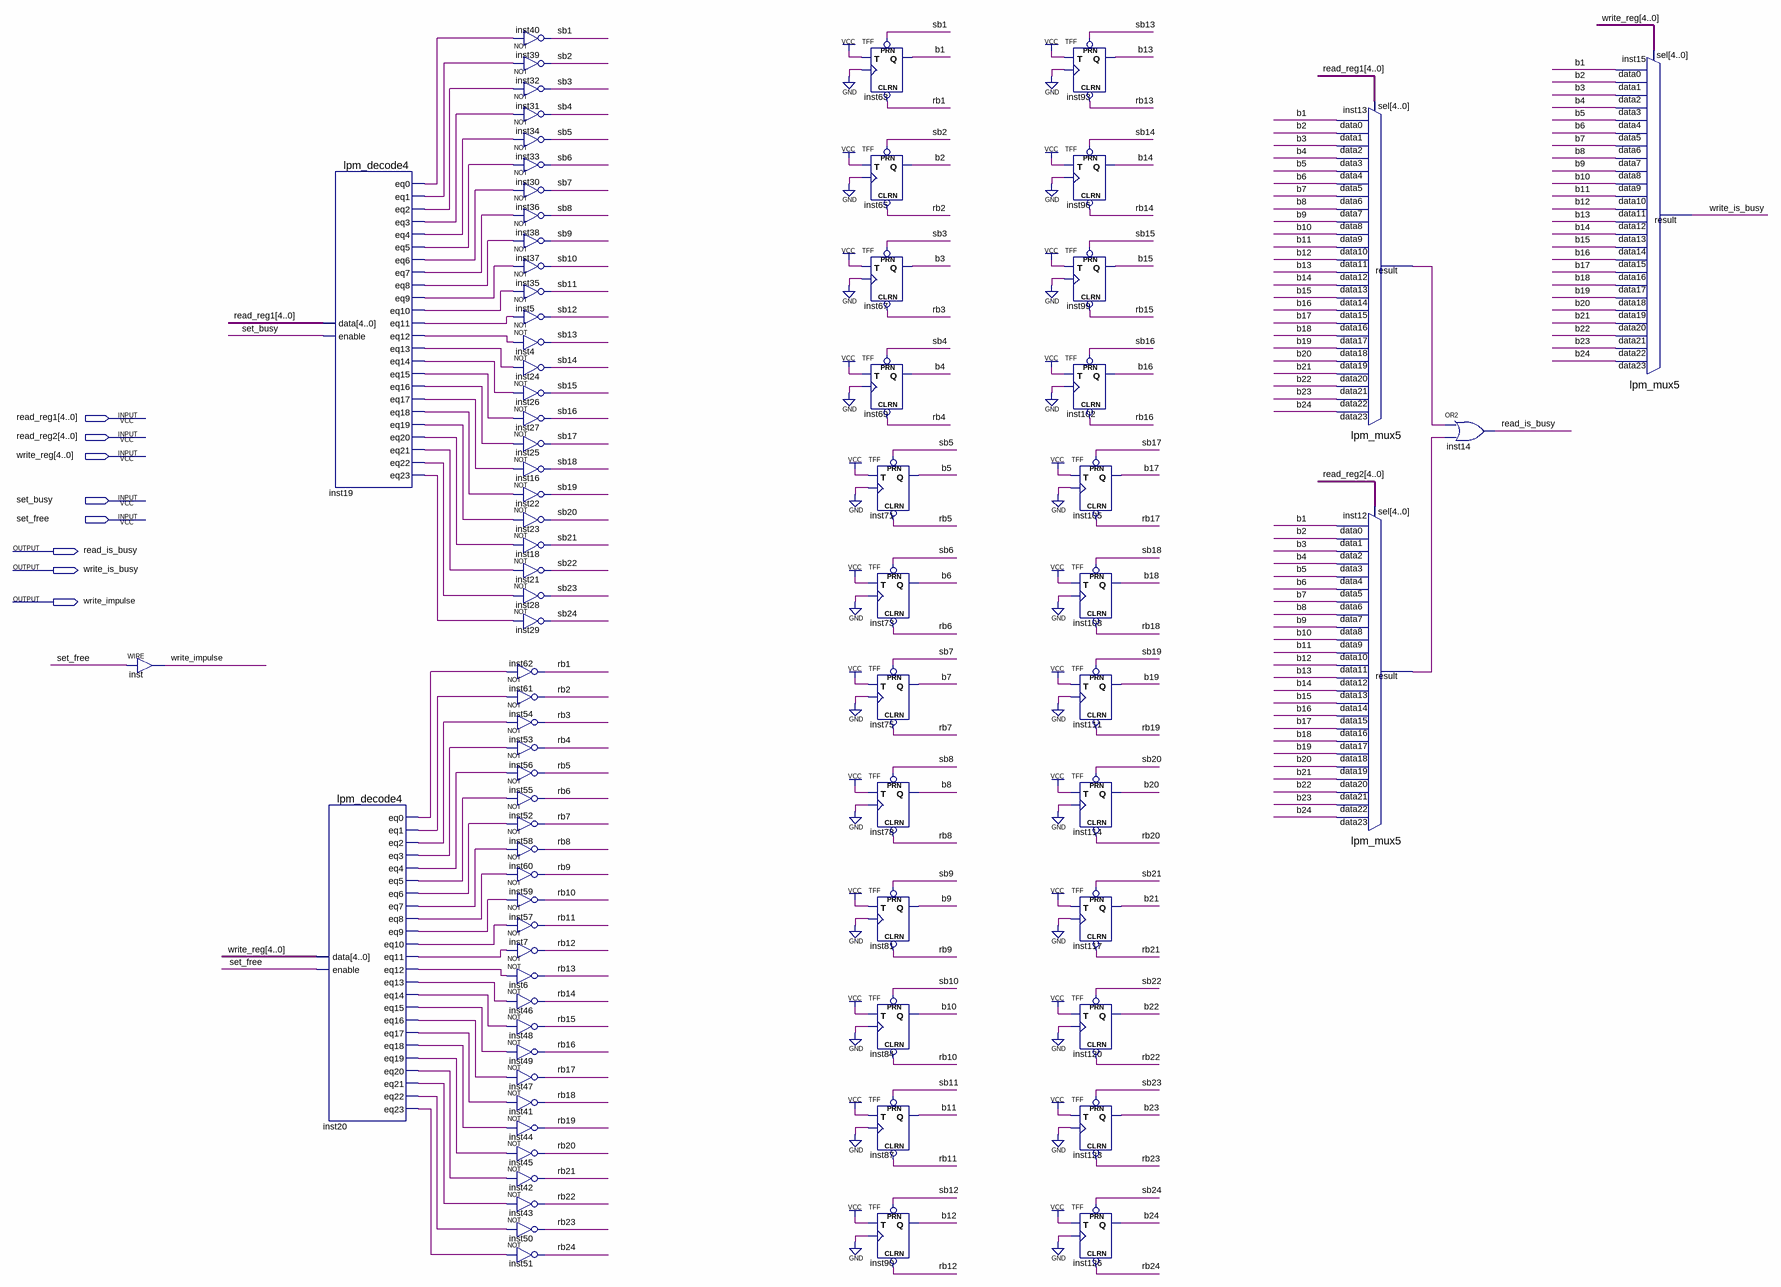
[diagram p0: schematic sheet]
// Quartus schematic RegistersControlUnit.bdf as structural Verilog: 79 symbols, 8 pins
module RegistersControlUnit (
  input  [4:0] read_reg1,
  input  [4:0] read_reg2,
  input  [4:0] write_reg,
  input  set_busy,
  input  set_free,
  output read_is_busy,
  output write_is_busy,
  output write_impulse
);

  wire b1, b2, b3, b4, b5, b6, b7, b8, b9, b10, b11, b12, b13, b14, b15, b16, b17, b18, b19, b20, b21, b22,
       b23, b24, inst12_result, inst13_result, inst19_eq0, inst19_eq1, inst19_eq2, inst19_eq3, inst19_eq4,
       inst19_eq5, inst19_eq6, inst19_eq7, inst19_eq8, inst19_eq9, inst19_eq10, inst19_eq11, inst19_eq12,
       inst19_eq13, inst19_eq14, inst19_eq15, inst19_eq16, inst19_eq17, inst19_eq18, inst19_eq19,
       inst19_eq20, inst19_eq21, inst19_eq22, inst19_eq23, inst20_eq0, inst20_eq1, inst20_eq2, inst20_eq3,
       inst20_eq4, inst20_eq5, inst20_eq6, inst20_eq7, inst20_eq8, inst20_eq9, inst20_eq10, inst20_eq11,
       inst20_eq12, inst20_eq13, inst20_eq14, inst20_eq15, inst20_eq16, inst20_eq17, inst20_eq18,
       inst20_eq19, inst20_eq20, inst20_eq21, inst20_eq22, inst20_eq23, rb1, rb2, rb3, rb4, rb5, rb6, rb7,
       rb8, rb9, rb10, rb11, rb12, rb13, rb14, rb15, rb16, rb17, rb18, rb19, rb20, rb21, rb22, rb23, rb24,
       sb1, sb2, sb3, sb4, sb5, sb6, sb7, sb8, sb9, sb10, sb11, sb12, sb13, sb14, sb15, sb16, sb17, sb18,
       sb19, sb20, sb21, sb22, sb23, sb24;

  assign write_impulse = set_free;  // WIRE inst
  lpm_decode4 inst19 (
    .data(read_reg1), .enable(set_busy), .eq0(inst19_eq0), .eq1(inst19_eq1), .eq2(inst19_eq2),
    .eq3(inst19_eq3), .eq4(inst19_eq4), .eq5(inst19_eq5), .eq6(inst19_eq6), .eq7(inst19_eq7),
    .eq8(inst19_eq8), .eq9(inst19_eq9), .eq10(inst19_eq10), .eq11(inst19_eq11), .eq12(inst19_eq12),
    .eq13(inst19_eq13), .eq14(inst19_eq14), .eq15(inst19_eq15), .eq16(inst19_eq16), .eq17(inst19_eq17),
    .eq18(inst19_eq18), .eq19(inst19_eq19), .eq20(inst19_eq20), .eq21(inst19_eq21), .eq22(inst19_eq22),
    .eq23(inst19_eq23));
  lpm_decode4 inst20 (
    .data(write_reg), .enable(set_free), .eq0(inst20_eq0), .eq1(inst20_eq1), .eq2(inst20_eq2),
    .eq3(inst20_eq3), .eq4(inst20_eq4), .eq5(inst20_eq5), .eq6(inst20_eq6), .eq7(inst20_eq7),
    .eq8(inst20_eq8), .eq9(inst20_eq9), .eq10(inst20_eq10), .eq11(inst20_eq11), .eq12(inst20_eq12),
    .eq13(inst20_eq13), .eq14(inst20_eq14), .eq15(inst20_eq15), .eq16(inst20_eq16), .eq17(inst20_eq17),
    .eq18(inst20_eq18), .eq19(inst20_eq19), .eq20(inst20_eq20), .eq21(inst20_eq21), .eq22(inst20_eq22),
    .eq23(inst20_eq23));
  not inst40 (sb1, inst19_eq0);
  not inst39 (sb2, inst19_eq1);
  not inst32 (sb3, inst19_eq2);
  not inst31 (sb4, inst19_eq3);
  not inst34 (sb5, inst19_eq4);
  not inst33 (sb6, inst19_eq5);
  not inst30 (sb7, inst19_eq6);
  not inst36 (sb8, inst19_eq7);
  not inst38 (sb9, inst19_eq8);
  not inst37 (sb10, inst19_eq9);
  not inst35 (sb11, inst19_eq10);
  not inst5 (sb12, inst19_eq11);
  not inst4 (sb13, inst19_eq12);
  not inst24 (sb14, inst19_eq13);
  not inst26 (sb15, inst19_eq14);
  not inst27 (sb16, inst19_eq15);
  not inst25 (sb17, inst19_eq16);
  not inst16 (sb18, inst19_eq17);
  not inst22 (sb19, inst19_eq18);
  not inst23 (sb20, inst19_eq19);
  not inst18 (sb21, inst19_eq20);
  not inst21 (sb22, inst19_eq21);
  not inst28 (sb23, inst19_eq22);
  not inst29 (sb24, inst19_eq23);
  not inst62 (rb1, inst20_eq0);
  not inst61 (rb2, inst20_eq1);
  not inst54 (rb3, inst20_eq2);
  not inst53 (rb4, inst20_eq3);
  not inst56 (rb5, inst20_eq4);
  not inst55 (rb6, inst20_eq5);
  not inst52 (rb7, inst20_eq6);
  not inst58 (rb8, inst20_eq7);
  not inst60 (rb9, inst20_eq8);
  not inst59 (rb10, inst20_eq9);
  not inst57 (rb11, inst20_eq10);
  not inst7 (rb12, inst20_eq11);
  not inst6 (rb13, inst20_eq12);
  not inst46 (rb14, inst20_eq13);
  not inst48 (rb15, inst20_eq14);
  not inst49 (rb16, inst20_eq15);
  not inst47 (rb17, inst20_eq16);
  not inst41 (rb18, inst20_eq17);
  not inst44 (rb19, inst20_eq18);
  not inst45 (rb20, inst20_eq19);
  not inst42 (rb21, inst20_eq20);
  not inst43 (rb22, inst20_eq21);
  not inst50 (rb23, inst20_eq22);
  not inst51 (rb24, inst20_eq23);
  TFF inst63 (.PRN(sb1), .CLRN(rb1), .T(1'b1), .CLK(1'b0), .Q(b1));
  TFF inst65 (.PRN(sb2), .CLRN(rb2), .T(1'b1), .CLK(1'b0), .Q(b2));
  TFF inst67 (.PRN(sb3), .CLRN(rb3), .T(1'b1), .CLK(1'b0), .Q(b3));
  TFF inst69 (.PRN(sb4), .CLRN(rb4), .T(1'b1), .CLK(1'b0), .Q(b4));
  TFF inst71 (.PRN(sb5), .CLRN(rb5), .T(1'b1), .CLK(1'b0), .Q(b5));
  TFF inst73 (.PRN(sb6), .CLRN(rb6), .T(1'b1), .CLK(1'b0), .Q(b6));
  TFF inst75 (.PRN(sb7), .CLRN(rb7), .T(1'b1), .CLK(1'b0), .Q(b7));
  TFF inst78 (.PRN(sb8), .CLRN(rb8), .T(1'b1), .CLK(1'b0), .Q(b8));
  TFF inst81 (.PRN(sb9), .CLRN(rb9), .T(1'b1), .CLK(1'b0), .Q(b9));
  TFF inst84 (.PRN(sb10), .CLRN(rb10), .T(1'b1), .CLK(1'b0), .Q(b10));
  TFF inst87 (.PRN(sb11), .CLRN(rb11), .T(1'b1), .CLK(1'b0), .Q(b11));
  TFF inst90 (.PRN(sb12), .CLRN(rb12), .T(1'b1), .CLK(1'b0), .Q(b12));
  TFF inst93 (.PRN(sb13), .CLRN(rb13), .T(1'b1), .CLK(1'b0), .Q(b13));
  TFF inst96 (.PRN(sb14), .CLRN(rb14), .T(1'b1), .CLK(1'b0), .Q(b14));
  TFF inst99 (.PRN(sb15), .CLRN(rb15), .T(1'b1), .CLK(1'b0), .Q(b15));
  TFF inst102 (.PRN(sb16), .CLRN(rb16), .T(1'b1), .CLK(1'b0), .Q(b16));
  TFF inst105 (.PRN(sb17), .CLRN(rb17), .T(1'b1), .CLK(1'b0), .Q(b17));
  TFF inst108 (.PRN(sb18), .CLRN(rb18), .T(1'b1), .CLK(1'b0), .Q(b18));
  TFF inst111 (.PRN(sb19), .CLRN(rb19), .T(1'b1), .CLK(1'b0), .Q(b19));
  TFF inst114 (.PRN(sb20), .CLRN(rb20), .T(1'b1), .CLK(1'b0), .Q(b20));
  TFF inst117 (.PRN(sb21), .CLRN(rb21), .T(1'b1), .CLK(1'b0), .Q(b21));
  TFF inst120 (.PRN(sb22), .CLRN(rb22), .T(1'b1), .CLK(1'b0), .Q(b22));
  TFF inst123 (.PRN(sb23), .CLRN(rb23), .T(1'b1), .CLK(1'b0), .Q(b23));
  TFF inst126 (.PRN(sb24), .CLRN(rb24), .T(1'b1), .CLK(1'b0), .Q(b24));
  lpm_mux5 inst13 (
    .data23(b24), .data22(b23), .data21(b22), .data20(b21), .data19(b20), .data18(b19), .data17(b18),
    .data16(b17), .data15(b16), .data14(b15), .data13(b14), .data12(b13), .data11(b12), .data10(b11),
    .data9(b10), .data8(b9), .data7(b8), .data6(b7), .data5(b6), .data4(b5), .data3(b4), .data2(b3),
    .data1(b2), .data0(b1), .sel(read_reg1), .result(inst13_result));
  lpm_mux5 inst12 (
    .data23(b24), .data22(b23), .data21(b22), .data20(b21), .data19(b20), .data18(b19), .data17(b18),
    .data16(b17), .data15(b16), .data14(b15), .data13(b14), .data12(b13), .data11(b12), .data10(b11),
    .data9(b10), .data8(b9), .data7(b8), .data6(b7), .data5(b6), .data4(b5), .data3(b4), .data2(b3),
    .data1(b2), .data0(b1), .sel(read_reg2), .result(inst12_result));
  or inst14 (read_is_busy, inst13_result, inst12_result);
  lpm_mux5 inst15 (
    .data23(b24), .data22(b23), .data21(b22), .data20(b21), .data19(b20), .data18(b19), .data17(b18),
    .data16(b17), .data15(b16), .data14(b15), .data13(b14), .data12(b13), .data11(b12), .data10(b11),
    .data9(b10), .data8(b9), .data7(b8), .data6(b7), .data5(b6), .data4(b5), .data3(b4), .data2(b3),
    .data1(b2), .data0(b1), .sel(write_reg), .result(write_is_busy));
endmodule
